# Altium project CUBE3.PrjPCB
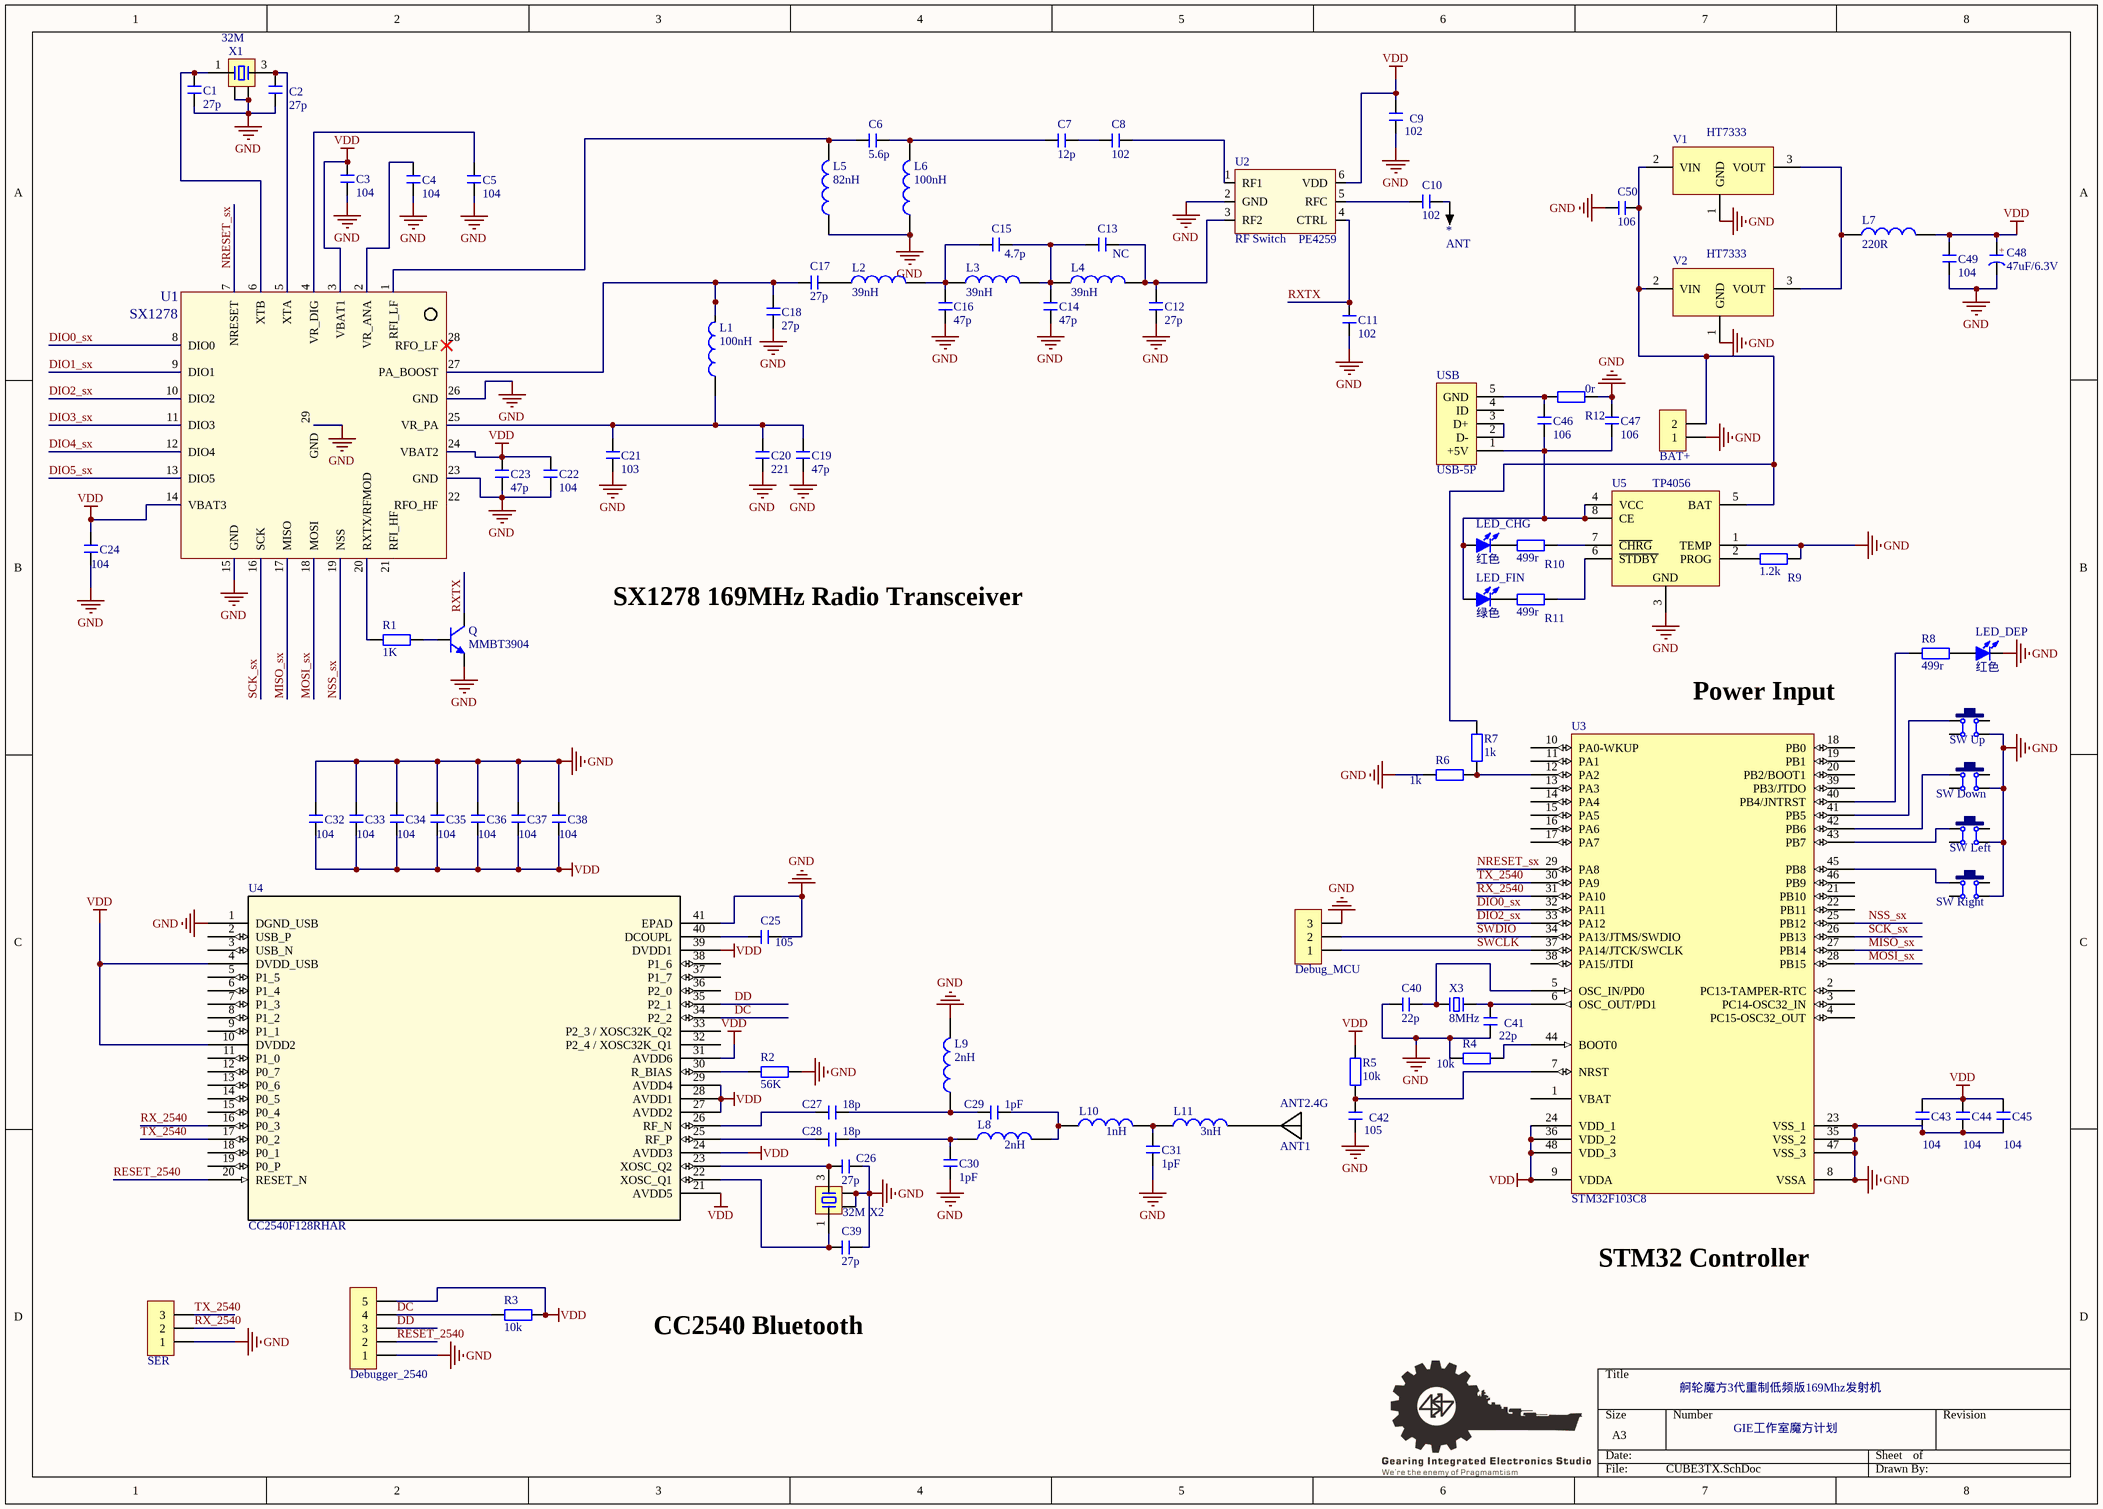
[diagram p0: CUBE3TX.SchDoc]
2 sheets, 179 parts. Net scope: global (net labels, ports and power ports of the same name join across sheets).
Board files: CUBE3TX.PcbDoc, CUBE3RX.PcbDoc
Sheets:
  CUBE3TX.SchDoc
  CUBE3RX.SchDoc

## Sheet CUBE3TX.SchDoc
size A3

### Parts
(Parts that share a designator on the sheet are numbered #1, #2 ... from top to bottom, then left to right.)
*#1  ANT  [R100]
ANT2.4G  ANT1  [Ant2_4]
BAT+  HDR-1X2  [HDR2.54-LI-2P]  (value not drawn)
C1#1  27p  [C 0603_L]
C2#1  27p  [C 0603_L]
C3#1  104  [C 0603_L]
C4#1  104  [C 0603_L]
C5#1  104  [C 0603_L]
C6#1  5.6p  [C 0402_L]
C7#1  12p  [C 0402_L]
C8#1  102  [C 0402_L]
C9#1  102  [C 0402_L]
C10#1  102  [C 0402_L]
C11#1  102  [C 0402_L]
C12#1  27p  [C 0402_L]
C13#1  NC  [C 0402_L]
C14#1  47p  [C 0402_L]
C15#1  4.7p  [C 0402_L]
C16#1  47p  [C 0402_L]
C17#1  27p  [C 0402_L]
C18#1  27p  [C 0402_L]
C19#1  47p  [C 0402_L]
C20#1  221  [C 0402_L]
C21#1  103  [C 0603_L]
C22#1  104  [C 0603_L]
C23#1  47p  [C 0402_L]
C24#1  104  [C 0603_L]
C25#1  105  [C 0402_L]
C26#1  27p  [C 0603_L]
C27#1  18p  [C 0603_L]
C28#1  18p  [C 0603_L]
C29#1  1pF  [C 0603_L]
C30#1  1pF  [C 0603_L]
C31#1  1pF  [C 0603_L]
C32#1  104  [C 0603_L]
C33#1  104  [C 0603_L]
C34  104  [C 0603_L]
C35  104  [C 0603_L]
C36  104  [C 0603_L]
C37  104  [C 0603_L]
C38  104  [C 0603_L]
C39  27p  [C 0603_L]
C40  22p  [C 0603_L]
C41  22p  [C 0603_L]
C42  105  [C 0603_L]
C43  104  [C 0603_L]
C44  104  [C 0603_L]
C45  104  [C 0603_L]
C46  106  [C 0805_L]
C47  106  [C 0805_L]
C48  47uF/6.3V  [CD A(3216)]
C49  104  [C 0603_L]
C50  106  [C 0805_L]
Debug_MCU  HDR-1X3  [HDR2.54-LI-3P]  (value not drawn)
Debugger_2540  HDR-1X5  [HDR2.54-LI-5P]  (value not drawn)
L1#1  100nH  [L 0402]
L2#1  39nH  [L 0402]
L3#1  39nH  [L 0402]
L4#1  39nH  [L 0402]
L5#1  82nH  [L 0402]
L6#1  100nH  [L 0402]
L7#1  220R  [L 0805]
L8  2nH  [L 0603]
L9  2nH  [L 0603]
L10  1nH  [L 0603]
L11  3nH  [L 0603]
LED_CHG  红色  [LED 0603B]
LED_DEP  红色  [LED 0603B]
LED_FIN  绿色  [LED 0603B]
Q  MMBT3904  [SOT23-3N]
R1#1  1K  [R 0603_L]
R2#1  56K  [R 0603_L]
R3#1  10k  [R 0603_L]
R4#1  10k  [R 0603_L]
R5#1  10k  [R 0603_L]
R6#1  1k  [R 0603_L]
R7  1k  [R 0603_L]
R8#1  499r  [R 0603_L]
R9#1  1.2k  [R 0603_L]
R10#1  499r  [R 0603_L]
R11#1  499r  [R 0603_L]
R12  0r  [R 1206_L]
SER  HDR-1X3  [HDR2.54-LI-3P]  (value not drawn)
SW_Down  6x6x5  [TSW DIP-6*6*6]  (value not drawn)
SW_Left  6x6x5  [TSW DIP-6*6*6]  (value not drawn)
SW_Right  6x6x5  [TSW DIP-6*6*6]  (value not drawn)
SW_Up  6x6x5  [TSW DIP-6*6*6]  (value not drawn)
U1#1  SX1278  [vqfn28_6x6mm]
U2#1  RF Switch  value PE4259  [SC70-6]
U3#1  STM32F103C8  [LQFP48 7X7_M]
U4#1  CC2540F128RHAR  [VQFN10X4-40PIN]
U5#1  TP4056  [SOP8_N]
USB  USB-5P  [USB-MICRO_A]
V1#1  HT7333  [SOT89_N]
V2#1  HT7333  [SOT89_N]
X1#1  32M  [OSC 3225-4P]
X2#1  32M  [OSC 3225-4P]
X3  8MHz  [OSC 5032-2P]

### Nets
GND: BAT+.1 C1#1.1 C2#1.1 C3#1.1 C4#1.1 C5#1.1 C9#1.1 C11#1.1 C12#1.1 C14#1.1 C16#1.1 C18#1.1 C19#1.1 C20#1.1 C21#1.1 C22#1.1 C23#1.1 C24#1.1 C25#1.2 C26#1.1 C30#1.2 C31#1.2 C32#1.2 C33#1.2 C34.2 C35.2 C36.2 C37.2 C38.2 C39.1 C40.1 C41.2 C42.2 C43.1 C44.1 C45.1 C47.1 C48.2(K) C49.2 C50.1 Debug_MCU.3 Debugger_2540.1 L5#1.1 L6#1.1 L9.2 LED_DEP.2(K) Q.2(E) R2#1.2 R4#1.2 R6#1.2 R9#1.2 R12.2 SER.1 SW_Down.3 SW_Left.3 SW_Right.3 SW_Up.3 U1#1.15(GND) U1#1.23(GND) U1#1.26(GND) U1#1.29(GND) U2#1.2(GND) U3#1.8(VSSA) U3#1.23(VSS_1) U3#1.35(VSS_2) U3#1.47(VSS_3) U4#1.1(DGND_USB) U4#1.41(EPAD) U5#1.1(TEMP) U5#1.3(GND) V1#1.1(GND) V2#1.1(GND) X1#1.2 X1#1.4 X2#1.2 X2#1.4
VDD: C3#1.2 C9#1.2 C22#1.2 C23#1.2 C24#1.2 C32#1.1 C33#1.1 C34.1 C35.1 C36.1 C37.1 C38.1 C43.2 C44.2 C45.2 C48.1(A) C49.1 Debugger_2540.5 L7#1.2 R3#1.1 R5#1.2 U1#1.3(VBAT1) U1#1.14(VBAT3) U1#1.24(VBAT2) U2#1.6(VDD) U3#1.9(VDDA) U3#1.24(VDD_1) U3#1.36(VDD_2) U3#1.48(VDD_3) U4#1.4(DVDD_USB) U4#1.10(DVDD2) U4#1.21(AVDD5) U4#1.24(AVDD3) U4#1.27(AVDD2) U4#1.28(AVDD1) U4#1.29(AVDD4) U4#1.31(AVDD6) U4#1.39(DVDD1)
DC: Debugger_2540.4 R3#1.2 U4#1.34(P2_2)
DD: Debugger_2540.3 U4#1.35(P2_1)
DIO0_sx: U1#1.8(DIO0) U3#1.32(PA11)
DIO1_sx: U1#1.9(DIO1)
DIO2_sx: U1#1.10(DIO2) U3#1.33(PA12)
DIO3_sx: U1#1.11(DIO3)
DIO4_sx: U1#1.12(DIO4)
DIO5_sx: U1#1.13(DIO5)
MISO_sx: U1#1.17(MISO) U3#1.27(PB14)
MOSI_sx: U1#1.18(MOSI) U3#1.28(PB15)
NRESET_sx: U1#1.7(NRESET) U3#1.29(PA8)
NSS_sx: U1#1.19(NSS) U3#1.25(PB12)
RESET_2540: Debugger_2540.2 U4#1.20(RESET_N)
RX_2540: SER.2 U3#1.31(PA10) U4#1.16(P0_3)
RXTX: C11#1.2 Q.3(C) U2#1.4(CTRL)
SCK_sx: U1#1.16(SCK) U3#1.26(PB13)
SWCLK: Debug_MCU.1 U3#1.37(PA14/JTCK/SWCLK)
SWDIO: Debug_MCU.2 U3#1.34(PA13/JTMS/SWDIO)
TX_2540: SER.3 U3#1.30(PA9) U4#1.17(P0_2)
Net*#1_1: *#1.1 C10#1.2
NetANT2.4G_1: ANT2.4G.1 L11.2
NetBAT+_2: BAT+.2 C50.2 R7.1 U5#1.5(BAT) V1#1.2(VIN) V2#1.2(VIN)
NetC1#1_2: C1#1.2 U1#1.6(XTB) X1#1.1
NetC2#1_2: C2#1.2 U1#1.5(XTA) X1#1.3
NetC4#1_2: C4#1.2 U1#1.2(VR_ANA)
NetC5#1_2: C5#1.2 U1#1.4(VR_DIG)
NetC6#1_1: C6#1.1 L5#1.2 U1#1.1(RFI_LF)
NetC6#1_2: C6#1.2 C7#1.1 L6#1.2
NetC7#1_2: C7#1.2 C8#1.1
NetC8#1_2: C8#1.2 U2#1.1(RF1)
NetC10#1_1: C10#1.1 U2#1.5(RFC)
NetC12#1_2: C12#1.2 C13#1.1 L4#1.2 U2#1.3(RF2)
NetC13#1_2: C13#1.2 C14#1.2 C15#1.1 L3#1.2 L4#1.1
NetC15#1_2: C15#1.2 C16#1.2 L2#1.2 L3#1.1
NetC17#1_1: C17#1.1 L2#1.1
NetC17#1_2: C17#1.2 C18#1.2 L1#1.2 U1#1.27(PA_BOOST)
NetC19#1_2: C19#1.2 C20#1.2 C21#1.2 L1#1.1 U1#1.25(VR_PA)
NetC25#1_1: C25#1.1 U4#1.40(DCOUPL)
NetC26#1_2: C26#1.2 U4#1.23(XOSC_Q2) X2#1.3
NetC27#1_1: C27#1.1 C29#1.2 L9.1
NetC27#1_2: C27#1.2 U4#1.26(RF_N)
NetC28#1_1: C28#1.1 C30#1.1 L8.1
NetC28#1_2: C28#1.2 U4#1.25(RF_P)
NetC29#1_1: C29#1.1 L8.2 L10.1
NetC31#1_1: C31#1.1 L10.2 L11.1
NetC39_2: C39.2 U4#1.22(XOSC_Q1) X2#1.1
NetC40_2: C40.2 U3#1.5(OSC_IN/PD0) X3.2
NetC41_1: C41.1 U3#1.6(OSC_OUT/PD1) X3.1
NetC42_1: C42.1 R5#1.1 U3#1.7(NRST)
NetC46_1: C46.1 R12.1 USB.5(GND)
NetC46_2: C46.2 C47.2 LED_CHG.1(A) LED_FIN.1(A) U5#1.4(VCC) U5#1.8(CE) USB.1(+5V)
NetL7#1_1: L7#1.1 V1#1.3(VOUT) V2#1.3(VOUT)
NetLED_CHG_2: LED_CHG.2(K) R10#1.1
NetLED_DEP_1: LED_DEP.1(A) R8#1.2
NetLED_FIN_2: LED_FIN.2(K) R11#1.1
NetQ_1: Q.1(B) R1#1.2
NetR1#1_1: R1#1.1 U1#1.20(RXTX/RFMOD)
NetR2#1_1: R2#1.1 U4#1.30(R_BIAS)
NetR4#1_1: R4#1.1 U3#1.44(BOOT0)
NetR6#1_1: R6#1.1 R7.2 U3#1.12(PA2)
NetR8#1_1: R8#1.1 U3#1.40(PB4/JNTRST)
NetR9#1_1: R9#1.1 U5#1.2(PROG)
NetR10#1_2: R10#1.2 U5#1.7(~{CHRG})
NetR11#1_2: R11#1.2 U5#1.6(~{STDBY})
NetSW_Down_1: SW_Down.1 U3#1.42(PB6)
NetSW_Left_1: SW_Left.1 U3#1.43(PB7)
NetSW_Right_1: SW_Right.1 U3#1.45(PB8)
NetSW_Up_1: SW_Up.1 U3#1.41(PB5)
NetUSB_2: USB.2(D-) USB.3(D+)

Not connected (* = marked no-connect by the designer): SW_Down 2 4; SW_Left 2 4; SW_Right 2 4; SW_Up 2 4; U1#1 21(RFI_HF) 22(RFO_HF) 28(RFO_LF)*; U3#1 1(VBAT) 2(PC13-TAMPER-RTC) 3(PC14-OSC32_IN) 4(PC15-OSC32_OUT) 10(PA0-WKUP) 11(PA1) 13(PA3) 14(PA4) 15(PA5) 16(PA6) 17(PA7) 18(PB0) 19(PB1) 20(PB2/BOOT1) 21(PB10) 22(PB11) 38(PA15/JTDI) 39(PB3/JTDO) 46(PB9); U4#1 2(USB_P) 3(USB_N) 5(P1_5) 6(P1_4) 7(P1_3) 8(P1_2) 9(P1_1) 11(P1_0) 12(P0_7) 13(P0_6) 14(P0_5) 15(P0_4) 18(P0_1) 19(P0_P) 32(P2_4_/_XOSC32K_Q1) 33(P2_3_/_XOSC32K_Q2) 36(P2_0) 37(P1_7) 38(P1_6); USB 4(ID)

### Notes on the sheet
- SX1278 169MHz Radio Transceiver
- (near U3#1) Power Input
- STM32 Controller
- CC2540 Bluetooth
- 舸轮魔方3代重制低频版169Mhz发射机
- GIE工作室魔方计划
- (in symbol C-CD) +

### Library data of the parts
*#1 = CS: 探针焊盘; 版权归属: 源创客; BOM名称: 探针焊盘; 学习资源: www.ooocke.com
ANT2.4G = ANT1: PCB板载天线; 版权归属: 源创客; BOM名称: PCB板载天线; 学习资源: www.ooocke.com
BAT+ = Header 2: 2P接插件; 版权归属: 源创客; BOM名称: 2P接插件; 学习资源: www.ooocke.com
C1#1 C2#1 C3#1 C4#1 C5#1 C6#1 C7#1 C8#1 C9#1 C10#1 C11#1 C12#1 C13#1 C14#1 C15#1 C16#1 C17#1 C18#1 C19#1 C20#1 C21#1 C22#1 C23#1 C24#1 C25#1 C26#1 C27#1 C28#1 C29#1 C30#1 C31#1 C32#1 C33#1 C34-C47 C49 C50 = C: 无极性贴片电容; 版权归属: 源创客; BOM名称: 无极性贴片电容; 学习资源: www.ooocke.com
C48 = C-CD: 贴片钽电容; 版权归属: 源创客; BOM名称: 贴片钽电容; 学习资源: www.ooocke.com
Debug_MCU SER = Header 3: 3P接插件; 版权归属: 源创客; BOM名称: 3P接插件; 学习资源: www.ooocke.com
Debugger_2540 = Header 5: 5P接插件; 版权归属: 源创客; BOM名称: 5P接插件; 学习资源: www.ooocke.com
L1#1 L2#1 L3#1 L4#1 L5#1 L6#1 L7#1 L8-L11 = L: 小功率贴片电感; 版权归属: 源创客; BOM名称: 小功率贴片电感; 学习资源: www.ooocke.com
LED_CHG LED_DEP LED_FIN = LED-SMD: 贴片LED; 版权归属: 源创客; BOM名称: 贴片LED; 学习资源: www.ooocke.com
Q = 8050-SMD: 高频放大-NPN型; 版权归属: 源创客; 属性: 40V 1.5A 1W 100MHZ; BOM名称: 高频放大-NPN型; 学习资源: www.ooocke.com
R1#1 R2#1 R3#1 R4#1 R5#1 R6#1 R7 R8#1 R9#1 R10#1 R11#1 R12 = R: 贴片电阻; 版权归属: 源创客; BOM名称: 贴片电阻; 学习资源: www.ooocke.com
SW_Down SW_Left SW_Right SW_Up = TSW DIP-6x6: 直插6x6轻触开关; 版权归属: 源创客; BOM名称: 直插6x6轻触开关; 学习资源: www.ooocke.com
U1#1 = SX1276: SX1276 - Low Power Integrated UHF Transceiver with loRa Modem; LatestRevisionDate: 27-Jul-2009 -  Semtech
U2#1 = PE4259 RF Switch: PE4259 Peregrine RF Switch; LatestRevisionDate: 03-Sep-2012 -  Semtech
U3#1 = STM32F103C8: Flaah:64/RAM:20/IO:36; BOM名称: 32位STM单片机; 版权归属: 源创客; 学习资源: www.ooocke.com
U4#1 = CC2540F128RHAR: 2.4GHz Bluetooth Low Energy System-on-Chip Solution; Manufacturer: Texas Instruments; GENERIC_PART_NUMBER: CC2540; INDUSTRY_STD_PKG_TYPE: VQFN; FAMILY_NAME: Bluetooth Low Energy Technology; PIN_COUNT: 40; PACKAGE_DESIGNATOR: RHA; Datasheet_URL: http://www.ti.com/lit/gpn/CC2540; Copyright: Copyright (C) 2018 Accelerated Designs. All rights reserved; RefDes: RefDes; Type: DEV; Value: Value
U5#1 = TP4056: 锂电池充电管理; 版权归属: 源创客; BOM名称: 锂电池充电管理; 学习资源: www.ooocke.com
USB = USB-5P: 微型USB母座; 版权归属: 源创客; BOM名称: 微型USB母座; 学习资源: www.ooocke.com
V1#1 V2#1 = HT71xx: LDO线性稳压芯片; 版权归属: 源创客; BOM名称: LDO线性稳压芯片; 学习资源: www.ooocke.com
X1#1 X2#1 = XTAL-4P: 4脚无源晶振; 版权归属: 源创客; BOM名称: 4脚无源晶振; 学习资源: www.ooocke.com
X3 = XTAL-2P: 2脚无源脚晶振; 版权归属: 源创客; BOM名称: 2脚无源脚晶振; 学习资源: www.ooocke.com

## Sheet CUBE3RX.SchDoc
size A3
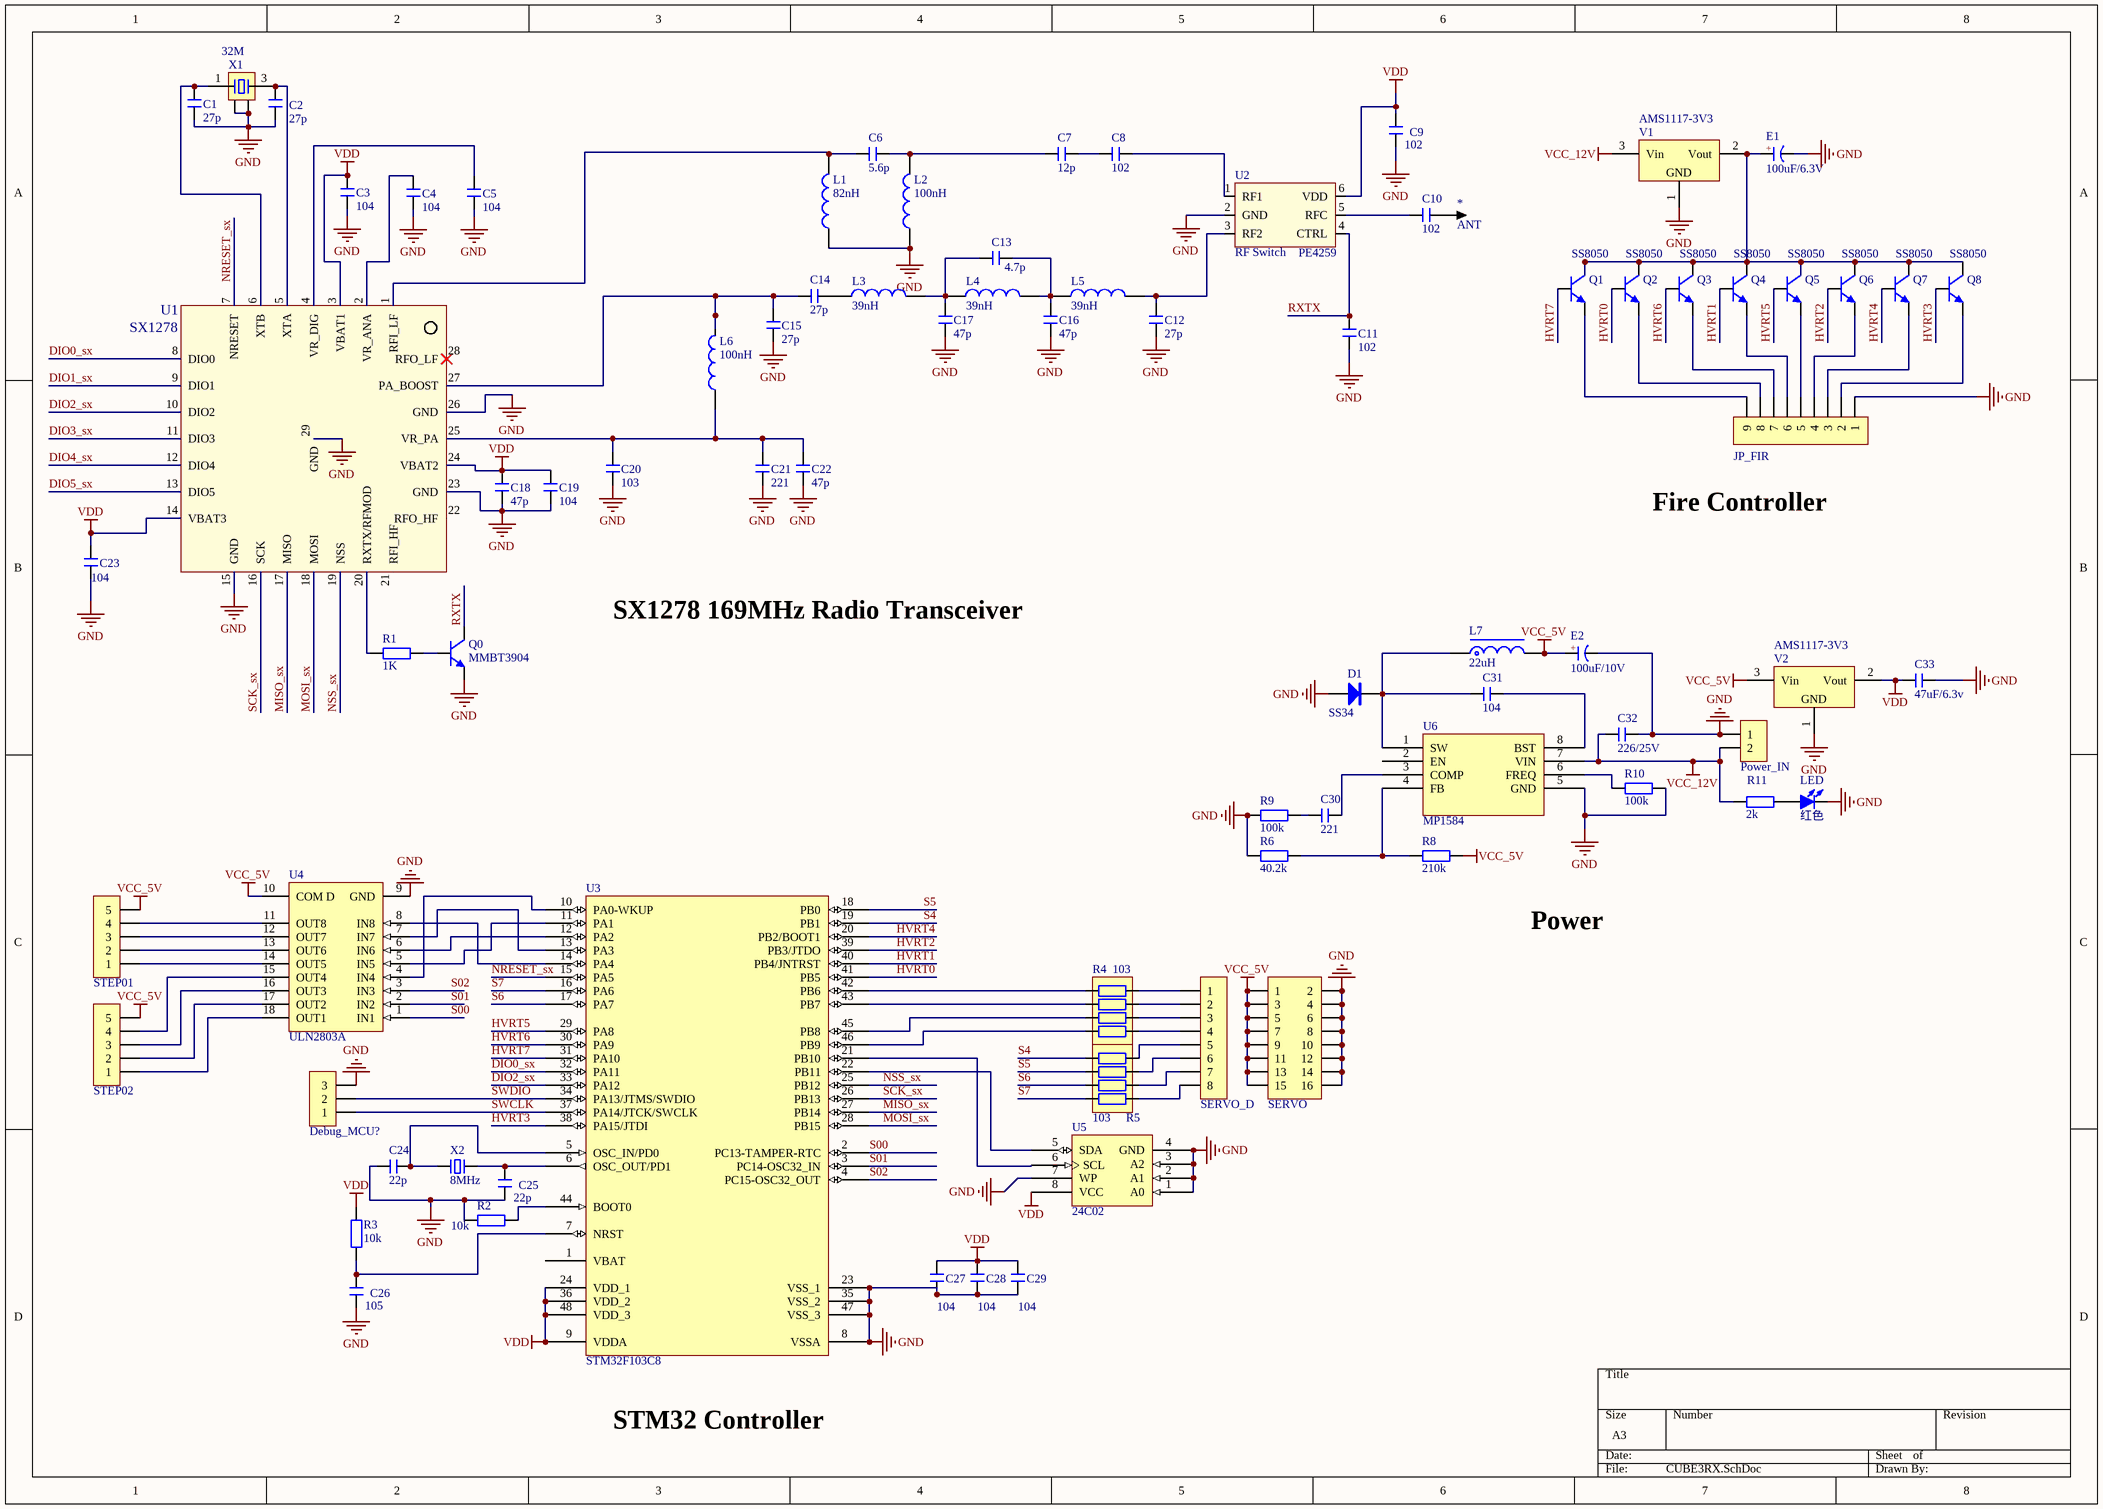
[diagram p1: CUBE3RX.SchDoc]

### Parts
(Parts that share a designator on the sheet are numbered #1, #2 ... from top to bottom, then left to right.)
*#2  ANT  [R100]
C1#2  27p  [C 0603_L]
C2#2  27p  [C 0603_L]
C3#2  104  [C 0603_L]
C4#2  104  [C 0603_L]
C5#2  104  [C 0603_L]
C6#2  5.6p  [C 0402_L]
C7#2  12p  [C 0402_L]
C8#2  102  [C 0402_L]
C9#2  102  [C 0402_L]
C10#2  102  [C 0402_L]
C11#2  102  [C 0402_L]
C12#2  27p  [C 0402_L]
C13#2  4.7p  [C 0402_L]
C14#2  27p  [C 0402_L]
C15#2  27p  [C 0402_L]
C16#2  47p  [C 0402_L]
C17#2  47p  [C 0402_L]
C18#2  47p  [C 0402_L]
C19#2  104  [C 0603_L]
C20#2  103  [C 0603_L]
C21#2  221  [C 0402_L]
C22#2  47p  [C 0402_L]
C23#2  104  [C 0603_L]
C24#2  22p  [C 0603_L]
C25#2  22p  [C 0603_L]
C26#2  105  [C 0603_L]
C27#2  104  [C 0603_L]
C28#2  104  [C 0603_L]
C29#2  104  [C 0603_L]
C30#2  221  [C 0603_L]
C31#2  104  [C 0603_L]
C32#2  226/25V  [C 1206_L]
C33#2  47uF/6.3v  [C 1206_L]
D1  SS34  [SMA]
Debug_MCU?  HDR-1X3  [HDR2.54-LI-3P]  (value not drawn)
E1  100uF/6.3V  [CM C(5*5.4)]
E2  100uF/10V  [CD B(3528)]
JP_FIR  HDR-1X9  [PH2.0-WS-9P]  (value not drawn)
L1#2  82nH  [L 0402]
L2#2  100nH  [L 0402]
L3#2  39nH  [L 0402]
L4#2  39nH  [L 0402]
L5#2  39nH  [L 0402]
L6#2  100nH  [L 0402]
L7#2  22uH  [NR4030]
LED  红色  [LED 0805G]
Power_IN  HDR-1X2  [XH2.54-LI-2P]  (value not drawn)
Q0  MMBT3904  [SOT23-3N]
Q1  SS8050  [SOT23-3N]
Q2  SS8050  [SOT23-3N]
Q3  SS8050  [SOT23-3N]
Q4  SS8050  [SOT23-3N]
Q5  SS8050  [SOT23-3N]
Q6  SS8050  [SOT23-3N]
Q7  SS8050  [SOT23-3N]
Q8  SS8050  [SOT23-3N]
R1#2  1K  [R 0603_L]
R2#2  10k  [R 0603_L]
R3#2  10k  [R 0603_L]
R4#2  103  [RCA-8P4R-0402]
R5#2  103  [RCA-8P4R-0402]
R6#2  40.2k  [R 0603_L]
R8#2  210k  [R 0603_L]
R9#2  100k  [R 0603_L]
R10#2  100k  [R 0603_L]
R11#2  2k  [R 0603_L]
SERVO  Header 8X2  [HDR2.54-LI-2x8P]  (value not drawn)
SERVO_D  HDR-1X8  [HDR2.54-LI-8P]  (value not drawn)
STEP01  HDR-1X5  [XH2.54-LI-5P]  (value not drawn)
STEP02  HDR-1X5  [XH2.54-LI-5P]  (value not drawn)
U1#2  SX1278  [vqfn28_6x6mm]
U2#2  RF Switch  value PE4259  [SC70-6]
U3#2  STM32F103C8  [LQFP48 7X7_M]
U4#2  ULN2803A  [SOP18W_N]
U5#2  24C02  [SOP8_L]
U6  MP1584  [SOP8_L]
V1#2  AMS1117-3V3  [SOT223_L]
V2#2  AMS1117-3V3  [SOT223_L]
X1#2  32M  [OSC 3225-4P]
X2#2  8MHz  [OSC 5032-2P]

### Nets
GND: C1#2.1 C2#2.1 C3#2.1 C4#2.1 C5#2.1 C9#2.1 C11#2.1 C12#2.1 C15#2.1 C16#2.1 C17#2.1 C18#2.1 C19#2.1 C20#2.1 C21#2.1 C22#2.1 C23#2.1 C24#2.1 C25#2.2 C26#2.2 C27#2.1 C28#2.1 C29#2.1 C32#2.2 C33#2.2 D1.1(A) Debug_MCU?.3 E1.2(K) E2.2(K) JP_FIR.1 L1#2.1 L2#2.1 LED.2(K) Power_IN.1 Q0.2(E) R2#2.2 R6#2.1 R9#2.1 R10#2.2 SERVO.2 SERVO.4 SERVO.6 SERVO.8 SERVO.10 SERVO.12 SERVO.14 SERVO.16 U1#2.15(GND) U1#2.23(GND) U1#2.26(GND) U1#2.29(GND) U2#2.2(GND) U3#2.8(VSSA) U3#2.23(VSS_1) U3#2.35(VSS_2) U3#2.47(VSS_3) U4#2.9(GND) U5#2.1(A0) U5#2.2(A1) U5#2.3(A2) U5#2.4(GND) U5#2.7(WP) U6.5(GND) V1#2.1(GND) V2#2.1(GND) X1#2.2 X1#2.4
VCC_5V: E2.1(A) L7#2.2 R8#2.2 SERVO.1 SERVO.3 SERVO.5 SERVO.7 SERVO.9 SERVO.11 SERVO.13 SERVO.15 STEP01.5 STEP02.5 U4#2.10(COM_D) V2#2.3(Vin)
VCC_12V: C32#2.1 Power_IN.2 R11#2.1 U6.7(VIN) V1#2.3(Vin)
VDD: C3#2.2 C9#2.2 C18#2.2 C19#2.2 C23#2.2 C27#2.2 C28#2.2 C29#2.2 C33#2.1 R3#2.2 U1#2.3(VBAT1) U1#2.14(VBAT3) U1#2.24(VBAT2) U2#2.6(VDD) U3#2.9(VDDA) U3#2.24(VDD_1) U3#2.36(VDD_2) U3#2.48(VDD_3) U5#2.8(VCC) V2#2.2(Vout)
DIO0_sx: U1#2.8(DIO0) U3#2.32(PA11)
DIO1_sx: U1#2.9(DIO1)
DIO2_sx: U1#2.10(DIO2) U3#2.33(PA12)
DIO3_sx: U1#2.11(DIO3)
DIO4_sx: U1#2.12(DIO4)
DIO5_sx: U1#2.13(DIO5)
HVRT0: Q2.1(B) U3#2.41(PB5)
HVRT1: Q4.1(B) U3#2.40(PB4/JNTRST)
HVRT2: Q6.1(B) U3#2.39(PB3/JTDO)
HVRT3: Q8.1(B) U3#2.38(PA15/JTDI)
HVRT4: Q7.1(B) U3#2.20(PB2/BOOT1)
HVRT5: Q5.1(B) U3#2.29(PA8)
HVRT6: Q3.1(B) U3#2.30(PA9)
HVRT7: Q1.1(B) U3#2.31(PA10)
MISO_sx: U1#2.17(MISO) U3#2.27(PB14)
MOSI_sx: U1#2.18(MOSI) U3#2.28(PB15)
NRESET_sx: U1#2.7(NRESET) U3#2.15(PA5)
NSS_sx: U1#2.19(NSS) U3#2.25(PB12)
RXTX: C11#2.2 Q0.3(C) U2#2.4(CTRL)
S00: U3#2.2(PC13-TAMPER-RTC) U4#2.1(IN1)
S01: U3#2.3(PC14-OSC32_IN) U4#2.2(IN2)
S02: U3#2.4(PC15-OSC32_OUT) U4#2.3(IN3)
S4: R5#2.1 U3#2.19(PB1)
S5: R5#2.2 U3#2.18(PB0)
S6: R5#2.3 U3#2.17(PA7)
S7: R5#2.4 U3#2.16(PA6)
SCK_sx: U1#2.16(SCK) U3#2.26(PB13)
SWCLK: Debug_MCU?.1 U3#2.37(PA14/JTCK/SWCLK)
SWDIO: Debug_MCU?.2 U3#2.34(PA13/JTMS/SWDIO)
Net*#2_1: *#2.1 C10#2.2
NetC1#2_2: C1#2.2 U1#2.6(XTB) X1#2.1
NetC2#2_2: C2#2.2 U1#2.5(XTA) X1#2.3
NetC4#2_2: C4#2.2 U1#2.2(VR_ANA)
NetC5#2_2: C5#2.2 U1#2.4(VR_DIG)
NetC6#2_1: C6#2.1 L1#2.2 U1#2.1(RFI_LF)
NetC6#2_2: C6#2.2 C7#2.1 L2#2.2
NetC7#2_2: C7#2.2 C8#2.1
NetC8#2_2: C8#2.2 U2#2.1(RF1)
NetC10#2_1: C10#2.1 U2#2.5(RFC)
NetC12#2_2: C12#2.2 L5#2.2 U2#2.3(RF2)
NetC13#2_1: C13#2.1 C16#2.2 L4#2.2 L5#2.1
NetC13#2_2: C13#2.2 C17#2.2 L3#2.2 L4#2.1
NetC14#2_1: C14#2.1 L3#2.1
NetC14#2_2: C14#2.2 C15#2.2 L6#2.2 U1#2.27(PA_BOOST)
NetC20#2_2: C20#2.2 C21#2.2 C22#2.2 L6#2.1 U1#2.25(VR_PA)
NetC24#2_2: C24#2.2 U3#2.5(OSC_IN/PD0) X2#2.2
NetC25#2_1: C25#2.1 U3#2.6(OSC_OUT/PD1) X2#2.1
NetC26#2_1: C26#2.1 R3#2.1 U3#2.7(NRST)
NetC30#2_1: C30#2.1 R9#2.2
NetC30#2_2: C30#2.2 U6.3(COMP)
NetC31#2_1: C31#2.1 D1.2(K) L7#2.1 U6.1(SW)
NetC31#2_2: C31#2.2 U6.8(BST)
NetE1_1: E1.1(A) Q1.3(C) Q2.3(C) Q3.3(C) Q4.3(C) Q5.3(C) Q6.3(C) Q7.3(C) Q8.3(C) V1#2.2(Vout)
NetJP_FIR_2: JP_FIR.2 Q8.2(E)
NetJP_FIR_3: JP_FIR.3 Q7.2(E)
NetJP_FIR_4: JP_FIR.4 Q6.2(E)
NetJP_FIR_5: JP_FIR.5 Q5.2(E)
NetJP_FIR_6: JP_FIR.6 Q4.2(E)
NetJP_FIR_7: JP_FIR.7 Q3.2(E)
NetJP_FIR_8: JP_FIR.8 Q2.2(E)
NetJP_FIR_9: JP_FIR.9 Q1.2(E)
NetLED_1: LED.1(A) R11#2.2
NetQ0_1: Q0.1(B) R1#2.2
NetR1#2_1: R1#2.1 U1#2.20(RXTX/RFMOD)
NetR2#2_1: R2#2.1 U3#2.44(BOOT0)
NetR4#2_1: R4#2.1 U3#2.42(PB6)
NetR4#2_2: R4#2.2 U3#2.43(PB7)
NetR4#2_3: R4#2.3 U3#2.45(PB8)
NetR4#2_4: R4#2.4 U3#2.46(PB9)
NetR4#2_5: R4#2.5 SERVO_D.4
NetR4#2_6: R4#2.6 SERVO_D.3
NetR4#2_7: R4#2.7 SERVO_D.2
NetR4#2_8: R4#2.8 SERVO_D.1
NetR5#2_5: R5#2.5 SERVO_D.8
NetR5#2_6: R5#2.6 SERVO_D.7
NetR5#2_7: R5#2.7 SERVO_D.6
NetR5#2_8: R5#2.8 SERVO_D.5
NetR6#2_2: R6#2.2 R8#2.1 U6.4(FB)
NetR10#2_1: R10#2.1 U6.6(FREQ)
NetSTEP01_1: STEP01.1 U4#2.14(OUT5)
NetSTEP01_2: STEP01.2 U4#2.13(OUT6)
NetSTEP01_3: STEP01.3 U4#2.12(OUT7)
NetSTEP01_4: STEP01.4 U4#2.11(OUT8)
NetSTEP02_1: STEP02.1 U4#2.18(OUT1)
NetSTEP02_2: STEP02.2 U4#2.17(OUT2)
NetSTEP02_3: STEP02.3 U4#2.16(OUT3)
NetSTEP02_4: STEP02.4 U4#2.15(OUT4)
NetU3#2_10: U3#2.10(PA0-WKUP) U4#2.4(IN4)
NetU3#2_11: U3#2.11(PA1) U4#2.5(IN5)
NetU3#2_12: U3#2.12(PA2) U4#2.6(IN6)
NetU3#2_13: U3#2.13(PA3) U4#2.7(IN7)
NetU3#2_14: U3#2.14(PA4) U4#2.8(IN8)
NetU3#2_21: U3#2.21(PB10) U5#2.6(SCL)
NetU3#2_22: U3#2.22(PB11) U5#2.5(SDA)

Not connected (* = marked no-connect by the designer): U1#2 21(RFI_HF) 22(RFO_HF) 28(RFO_LF)*; U3#2 1(VBAT); U6 2(EN)

### Notes on the sheet
- Fire Controller
- SX1278 169MHz Radio Transceiver
- Power
- STM32 Controller
- (in symbol C-CD) +
- (in symbol C-CM) +

### Library data of the parts
*#2 = CS: 探针焊盘; 版权归属: 源创客; BOM名称: 探针焊盘; 学习资源: www.ooocke.com
C1#2 C2#2 C3#2 C4#2 C5#2 C6#2 C7#2 C8#2 C9#2 C10#2 C11#2 C12#2 C13#2 C14#2 C15#2 C16#2 C17#2 C18#2 C19#2 C20#2 C21#2 C22#2 C23#2 C24#2 C25#2 C26#2 C27#2 C28#2 C29#2 C30#2 C31#2 C32#2 C33#2 = C: 无极性贴片电容; 版权归属: 源创客; BOM名称: 无极性贴片电容; 学习资源: www.ooocke.com
D1 = SS14: 肖特基二极管; 版权归属: 源创客; 属性: 40V/1A; BOM名称: 肖特基二极管; 学习资源: www.ooocke.com
Debug_MCU? = Header 3: 3P接插件; 版权归属: 源创客; BOM名称: 3P接插件; 学习资源: www.ooocke.com
E1 = C-CM: 贴片电解电容; 版权归属: 源创客; BOM名称: 贴片电解电容; 学习资源: www.ooocke.com
E2 = C-CD: 贴片钽电容; 版权归属: 源创客; BOM名称: 贴片钽电容; 学习资源: www.ooocke.com
JP_FIR = Header 9: 9P接插件; 版权归属: 源创客; BOM名称: 9P接插件; 学习资源: www.ooocke.com
L1#2 L2#2 L3#2 L4#2 L5#2 L6#2 = L: 小功率贴片电感; 版权归属: 源创客; BOM名称: 小功率贴片电感; 学习资源: www.ooocke.com
L7#2 = L-NR: NR磁胶电感; 版权归属: 源创客; BOM名称: NR磁胶电感; 学习资源: www.ooocke.com
LED = LED-SMD: 贴片LED; 版权归属: 源创客; BOM名称: 贴片LED; 学习资源: www.ooocke.com
Power_IN = Header 2: 2P接插件; 版权归属: 源创客; BOM名称: 2P接插件; 学习资源: www.ooocke.com
Q0-Q8 = 8050-SMD: as Q on sheet CUBE3TX; BOM名称: 高频放大-NPN型; 学习资源: www.ooocke.com
R1#2 R2#2 R3#2 R6#2 R8#2 R9#2 R10#2 R11#2 = R: 贴片电阻; 版权归属: 源创客; BOM名称: 贴片电阻; 学习资源: www.ooocke.com
R4#2 R5#2 = R-8P4R: 贴片网络排阻; 版权归属: 源创客; BOM名称: 贴片网络排阻; 学习资源: www.ooocke.com
SERVO = Header 8X2: 8*2P接插件; 版权归属: 源创客; BOM名称: 8*2P接插件; 学习资源: www.ooocke.com
SERVO_D = Header 8: 8P接插件; 版权归属: 源创客; BOM名称: 8P接插件; 学习资源: www.ooocke.com
STEP01 STEP02 = Header 5: 5P接插件; 版权归属: 源创客; BOM名称: 5P接插件; 学习资源: www.ooocke.com
U1#2 = SX1276: as U1#1 on sheet CUBE3TX; LatestRevisionDate: 27-Jul-2009 -  Semtech
U2#2 = PE4259 RF Switch: PE4259 Peregrine RF Switch; LatestRevisionDate: 03-Sep-2012 -  Semtech
U3#2 = STM32F103C8: as U3#1 on sheet CUBE3TX; 学习资源: www.ooocke.com
U4#2 = ULN2803A: Eight Darlington Array; Published: 8-Jun-2000; LatestRevisionDate: 17-Jul-2002; LatestRevisionNote: Re-released for DXP Platform.; DatasheetDocument: Sep-1997; PackageReference: DIP18; Publisher: Altium Limited
U5#2 = 24Cxx: 外置EEPROM; 版权归属: 源创客; BOM名称: 外置EEPROM; 学习资源: www.ooocke.com
V1#2 V2#2 = AMS1117: 三端稳压芯片; BOM名称: 稳压芯片; 版权归属: 源创客; 学习资源: www.ooocke.com
X1#2 = XTAL-4P: 4脚无源晶振; 版权归属: 源创客; BOM名称: 4脚无源晶振; 学习资源: www.ooocke.com
X2#2 = XTAL-2P: 2脚无源脚晶振; 版权归属: 源创客; BOM名称: 2脚无源脚晶振; 学习资源: www.ooocke.com

## Nets that join several sheets
GND: CUBE3TX (76 pins), CUBE3RX (67 pins)
VDD: CUBE3TX (38 pins), CUBE3RX (20 pins)
DIO0_sx: CUBE3TX (U1#1.8 U3#1.32), CUBE3RX (U1#2.8 U3#2.32)
DIO1_sx: CUBE3TX (U1#1.9), CUBE3RX (U1#2.9)
DIO2_sx: CUBE3TX (U1#1.10 U3#1.33), CUBE3RX (U1#2.10 U3#2.33)
DIO3_sx: CUBE3TX (U1#1.11), CUBE3RX (U1#2.11)
DIO4_sx: CUBE3TX (U1#1.12), CUBE3RX (U1#2.12)
DIO5_sx: CUBE3TX (U1#1.13), CUBE3RX (U1#2.13)
MISO_sx: CUBE3TX (U1#1.17 U3#1.27), CUBE3RX (U1#2.17 U3#2.27)
MOSI_sx: CUBE3TX (U1#1.18 U3#1.28), CUBE3RX (U1#2.18 U3#2.28)
NRESET_sx: CUBE3TX (U1#1.7 U3#1.29), CUBE3RX (U1#2.7 U3#2.15)
NSS_sx: CUBE3TX (U1#1.19 U3#1.25), CUBE3RX (U1#2.19 U3#2.25)
RXTX: CUBE3TX (C11#1.2 Q.3 U2#1.4), CUBE3RX (C11#2.2 Q0.3 U2#2.4)
SCK_sx: CUBE3TX (U1#1.16 U3#1.26), CUBE3RX (U1#2.16 U3#2.26)
SWCLK: CUBE3TX (Debug_MCU.1 U3#1.37), CUBE3RX (Debug_MCU?.1 U3#2.37)
SWDIO: CUBE3TX (Debug_MCU.2 U3#1.34), CUBE3RX (Debug_MCU?.2 U3#2.34)